# EAGLE schematic VidorCameraLock (EAGLE 9.2.2)
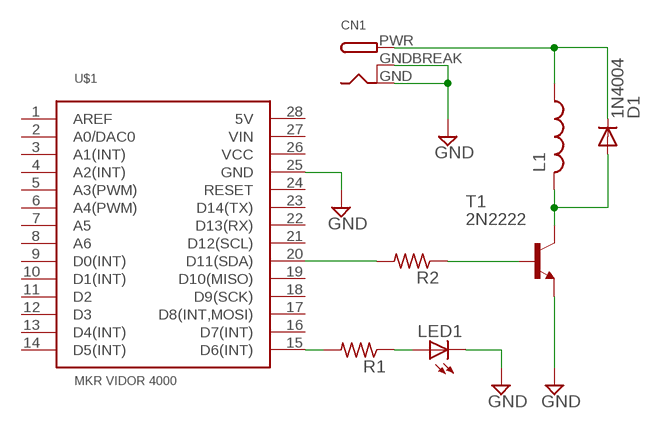
[diagram p0: schematic, sheet 1]

## Parts
CN1  DCBARRELPTH  [DCJACK_2MM_PTH]
D1  1N4004  [DO41-10]
L1  L-US0204/7  [0204/7]
LED1  LED3MM  [LED3MM]
R1  R-US_0207/5V  [0207/5V]
R2  R-US_0207/5V  [0207/5V]
T1  2N2222  [TO92-EBC-OVAL]
U$1  MKR VIDOR 4000  MKR1000  [MKR1000-SOCKET]

## Nets
GND: CN1.GND CN1.GNDBREAK LED1.K(C) T1.E U$1.25(GND)
N$1: LED1.A R1.1
N$2: R1.2 U$1.15(D6(INT))
N$3: D1.A L1.2 T1.C
N$4: CN1.PWR D1.C L1.1
N$5: R2.1 T1.B
N$6: R2.2 U$1.20(D11(SDA))
Unconnected: U$1.1(AREF) U$1.2(A0/DAC0) U$1.3(A1(INT)) U$1.4(A2(INT)) U$1.5(A3(PWM)) U$1.6(A4(PWM)) U$1.7(A5) U$1.8(A6) U$1.9(D0(INT)) U$1.10(D1(INT)) U$1.11(D2) U$1.12(D3) U$1.13(D4(INT)) U$1.14(D5(INT)) U$1.16(D7(INT)) U$1.17(D8(INT,MOSI)) U$1.18(D9(SCK)) U$1.19(D10(MISO)) U$1.21(D12(SCL)) U$1.22(D13(RX)) U$1.23(D14(TX)) U$1.24(RESET) U$1.26(VCC) U$1.27(VIN) U$1.28(5V)

## Library data of the parts
CN1 = adafruit:DCBARREL: 2.0mm DC Barrel Jack DCJACK_2MM_PTH - Through Hole Jack (4UConnector: 05537)
D1 = adafruit:1N4004: DIODE General purpose 1N400x type rectifier (With bigger pads) http://www.ladyada.net/library/pcb/eaglelibrary.html
L1 = resistor:L-US: INDUCTOR, American symbol
LED1 = adafruit:LED: LED OSRAM: - CHIPLED LG R971, LG N971, LY N971, LG Q971, LY Q971, LO R971, LY R971 LH N974, LH R974 LS Q976, LO Q976, LY Q976 LO Q996 - Hyper CHIPLED LW Q18S LB Q993, LB Q99A, LB R99A - SideLED LS A670, LO A670, LY A670, LG A670, LP A670 LB A673, LV A673, LT A673, LW A673 LH A674 LY A675 LS A676, LA A676, LO A676, LY A676, LW A676 LS A679, LY A679, LG A679 - Hyper Micro SIDELED® LS Y876, LA Y876, LO Y876, LY Y876 LT Y87S - SmartLED LW L88C, LW L88S LB L89C, LB L89S, LG L890 LS L89K, LO L89K, LY L89K LS L896, LA L896, LO L896, LY L896 - TOPLED LS T670, LO T670, LY T670, LG T670, LP T670 LSG T670, LSP T670, LSY T670, LOP T670, LYG T670 LG T671, LOG T671, LSG T671 LB T673, LV T673, LT T673, LW T673 LH T674 LS T676, LA T676, LO T676, LY T676, LB T676, LH T676, LSB T676, LW T676 LB T67C, LV T67C, LT T67C, LS T67K, LO T67K, LY T67K, LW E67C LS E67B, LA E67B, LO E67B, LY E67B, LB E67C, LV E67C, LT E67C LW T67C LS T679, LY T679, LG T679 LS T770, LO T770, LY T770, LG T770, LP T770 LB T773, LV T773, LT T773, LW T773 LH T774 LS E675, LA E675, LY E675, LS T675 LS T776, LA T776, LO T776, LY T776, LB T776 LHGB T686 LT T68C, LB T68C - Hyper Mini TOPLED® LB M676 - Mini TOPLED Santana® LG M470 LS M47K, LO M47K, LY M47K Source: http://www.osram.convergy.de/
R1 R2 = adafruit:R-US_: RESISTOR, American symbol
T1 = adafruit:2N2222: NPN TRANSISTOR Big oval pads
U$1 = IAD-Library:MKR1000: The Arduino MKR1000.